# Altium schematic sheet USB HUB 3.0.SchDoc
size 381 x 304 mm
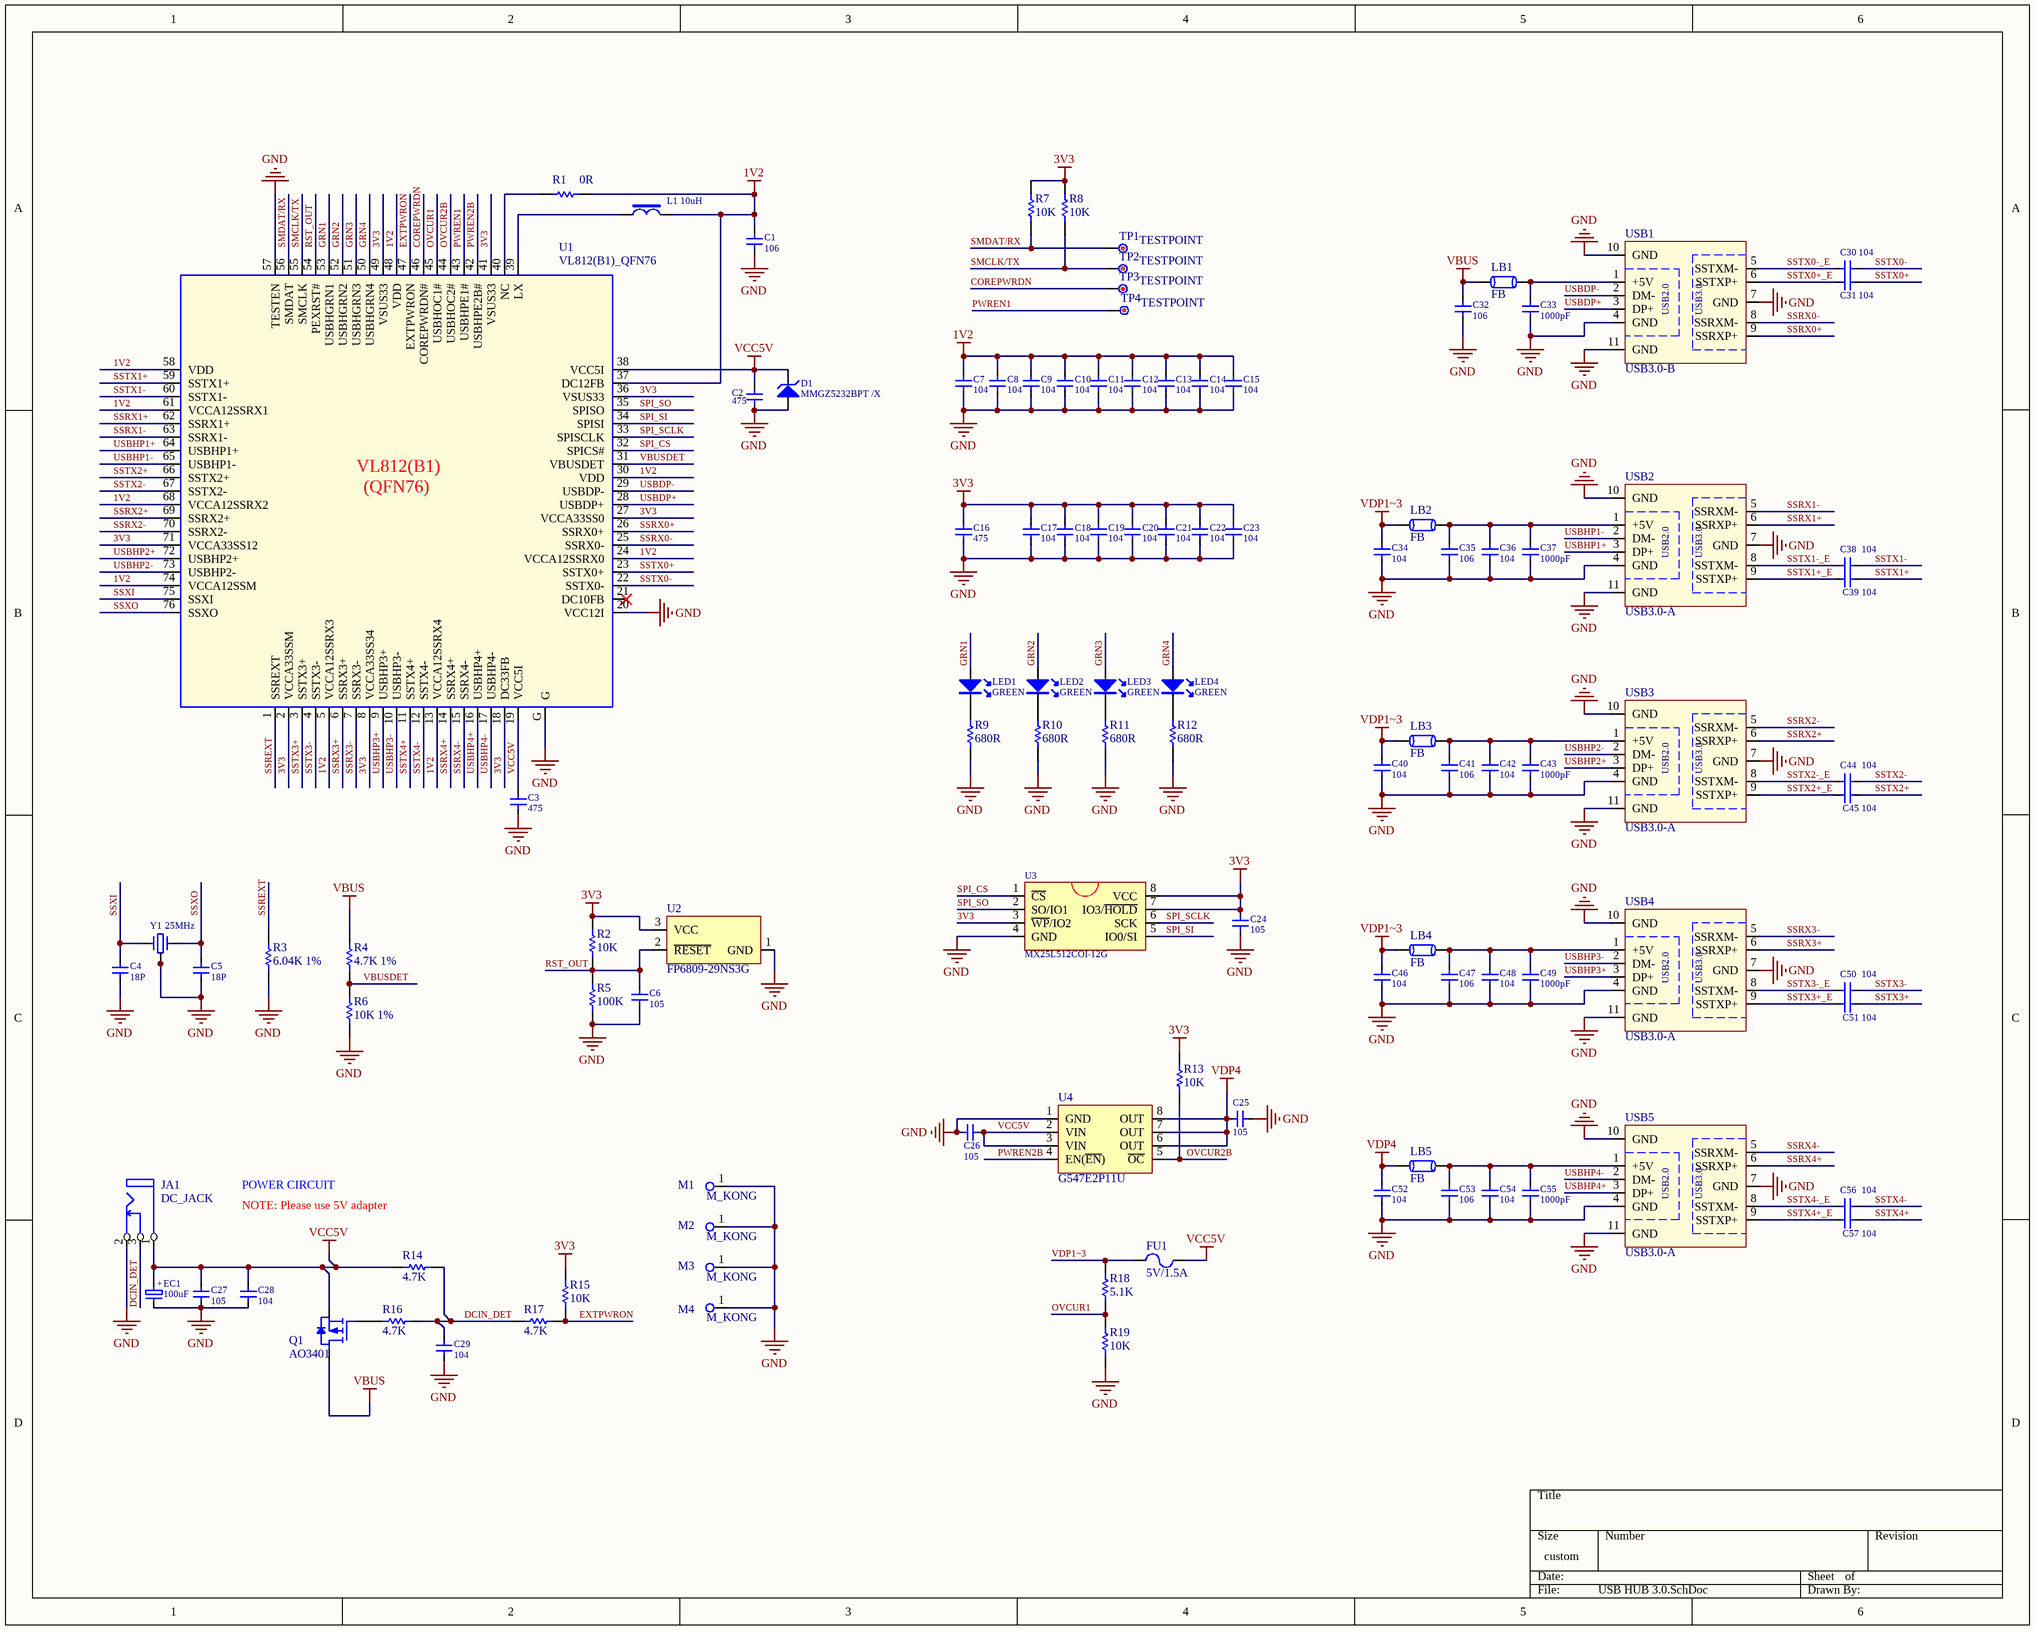
[diagram p0: USB HUB 3.0.SchDoc]

## Parts
C1  106  [C0603]
C2  475  [C0805]
C3  475  [C0805]
C4  18P  [C0402]
C5  18P  [C0402]
C6  105  [C0402]
C7  104  [C0402]
C8  104  [C0402]
C9  104  [C0402]
C10  104  [C0402]
C11  104  [C0402]
C12  104  [C0402]
C13  104  [C0402]
C14  104  [C0402]
C15  104  [C0402]
C16  475  [C0603]
C17  104  [C0402]
C18  104  [C0402]
C19  104  [C0402]
C20  104  [C0402]
C21  104  [C0402]
C22  104  [C0402]
C23  104  [C0402]
C24  105  [C0402]
C25  105  [C0402]
C26  105  [C0402]
C27  105  [C0603]
C28  104  [C0402]
C29  104  [C0402]
C30  104  [C0402]
C31  104  [C0402]
C32  106  [C0805]
C33  1000pF  [C0402]
C34  104  [C0402]
C35  106  [C0805]
C36  104  [C0402]
C37  1000pF  [C0402]
C38  104  [C0402]
C39  104  [C0402]
C40  104  [C0402]
C41  106  [C0805]
C42  104  [C0402]
C43  1000pF  [C0402]
C44  104  [C0402]
C45  104  [C0402]
C46  104  [C0402]
C47  106  [C0805]
C48  104  [C0402]
C49  1000pF  [C0402]
C50  104  [C0402]
C51  104  [C0402]
C52  104  [C0402]
C53  106  [C0805]
C54  104  [C0402]
C55  1000pF  [C0402]
C56  104  [C0402]
C57  104  [C0402]
D1  MMGZ5232BPT /X  [LL-34]
EC1  100uF  [C_SMD(6.3x7.7)]
FU1  5V/1.5A  [FU1210]
JA1  DC_JACK  [DC_005]
L1  10uH  [CD53]
LB1  FB  [L0805]
LB2  FB  [L0805]
LB3  FB  [L0805]
LB4  FB  [L0805]
LB5  FB  [L0805]
LED1  GREEN  [LED_0603]
LED2  GREEN  [LED_0603]
LED3  GREEN  [LED_0603]
LED4  GREEN  [LED_0603]
M1  M_KONG  [M3*8]
M2  M_KONG  [M3*8]
M3  M_KONG  [M3*8]
M4  M_KONG  [M3*8]
Q1  AO3401  [SOT23]
R1  0R  [R0402]
R2  10K  [R0402]
R3  6.04K 1%  [R0402]
R4  4.7K 1%  [R0402]
R5  100K  [R0402]
R6  10K 1%  [R0402]
R7  10K  [R0402]
R8  10K  [R0402]
R9  680R  [R0402]
R10  680R  [R0402]
R11  680R  [R0402]
R12  680R  [R0402]
R13  10K  [R0402]
R14  4.7K  [R0402]
R15  10K  [R0402]
R16  4.7K  [R0402]
R17  4.7K  [R0402]
R18  5.1K  [R0402]
R19  10K  [R0402]
TP1  TESTPOINT  [TP]
TP2  TESTPOINT  [TP]
TP3  TESTPOINT  [TP]
TP4  TESTPOINT  [TP]
U1  VL812(B1)_QFN76  [QFN76-0.4_9*9]
U2  FP6809-29NS3G  [SOT23]
U3  MX25L512COI-12G  [SOIC8]
U4  G547E2P11U  [SOP8]
USB1  USB3.0-B  [USB3.0-B]
USB2  USB3.0-A  [USB3.0-A]
USB3  USB3.0-A  [USB3.0-A]
USB4  USB3.0-A  [USB3.0-A]
USB5  USB3.0-A  [USB3.0-A]
Y1  25MHz  [0SC-3225_4]

## Nets
1V2: C1.1 C7.1 C8.1 C9.1 C10.1 C11.1 C12.1 C13.1 C14.1 C15.1 L1.2 R1.1 U1.5(VCCA12SSRX3) U1.13(VCCA12SSRX4) U1.24(VCCA12SSRX0) U1.30(VDD) U1.37(DC12FB) U1.48(VDD) U1.58(VDD) U1.61(VCCA12SSRX1) U1.68(VCCA12SSRX2) U1.74(VCCA12SSM)
3V3: C16.1 C17.1 C18.1 C19.1 C20.1 C21.1 C22.1 C23.1 C24.1 R2.1 R7.1 R8.1 R13.2 R15.2 U1.2(VCCA33SSM) U1.8(VCCA33SS34) U1.18(DC33FB) U1.27(VCCA33SS0) U1.36(VSUS33) U1.41(VSUS33) U1.49(VSUS33) U1.71(VCCA33SS12) U2.3(VCC) U3.3(~{WP}/IO2) U3.7(IO3/~{HOLD}) U3.8(VCC)
GND: C1.2 C2.2 C3.2 C4.2 C5.2 C6.2 C7.2 C8.2 C9.2 C10.2 C11.2 C12.2 C13.2 C14.2 C15.2 C16.2 C17.2 C18.2 C19.2 C20.2 C21.2 C22.2 C23.2 C24.2 C25.2 C26.1 C27.1 C28.1 C29.1 C32.2 C33.2 C34.2 C35.2 C36.2 C37.2 C40.2 C41.2 C42.2 C43.2 C46.2 C47.2 C48.2 C49.2 C52.2 C53.2 C54.2 C55.2 D1.1 EC1.2 JA1.2 M1.1 M2.1 M3.1 M4.1 R3.2 R5.2 R6.2 R9.2 R10.2 R11.2 R12.2 R19.2 U1.20(VCC12I) U1.57(TESTEN) U1.G U2.1(GND) U3.4(GND) U4.1(GND) USB1.4(GND) USB1.7(GND) USB1.10(GND) USB1.11(GND) USB2.4(GND) USB2.7(GND) USB2.10(GND) USB2.11(GND) USB3.4(GND) USB3.7(GND) USB3.10(GND) USB3.11(GND) USB4.4(GND) USB4.7(GND) USB4.10(GND) USB4.11(GND) USB5.4(GND) USB5.7(GND) USB5.10(GND) USB5.11(GND) Y1.3 Y1.4
VBUS: C32.1 LB1.1 Q1.3(D) R4.1
VCC5V: C2.1 C3.1 C26.2 C27.2 C28.2 D1.2 EC1.1 FU1.2 JA1.1 Q1.2(S) R14.1 U1.19(VCC5I) U1.38(VCC5I) U4.2(VIN) U4.3(VIN)
VDP1~3: C34.1 C40.1 C46.1 FU1.1 LB2.1 LB3.1 LB4.1 R18.1
VDP4: C25.1 C52.1 LB5.1 U4.6(OUT) U4.7(OUT) U4.8(OUT)
COREPWRDN: TP3.1 U1.46(COREPWRDN#)
DCIN_DET: C29.2 JA1.3 R14.2 R16.1 R17.2
EXTPWRON: R15.1 R17.1 U1.47(EXTPWRON)
GRN1: LED1.1(A) U1.53(USBHGRN1)
GRN2: LED2.1(A) U1.52(USBHGRN2)
GRN3: LED3.1(A) U1.51(USBHGRN3)
GRN4: LED4.1(A) U1.50(USBHGRN4)
OVCUR1: R18.2 R19.1 U1.45(USBHOC1#)
OVCUR2B: R13.1 U1.44(USBHOC2#) U4.5(~{OC})
PWREN1: TP4.1 U1.43(USBHPE1#)
PWREN2B: U1.42(USBHPE2B#) U4.4(EN(~{EN}))
RST_OUT: C6.1 R2.2 R5.1 U1.54(PEXRST#) U2.2(~{RESET})
SMCLK/TX: R8.2 TP2.1 U1.55(SMCLK)
SMDAT/RX: R7.2 TP1.1 U1.56(SMDAT)
SPI_CS: U1.32(SPICS#) U3.1(~{CS})
SPI_SCLK: U1.33(SPISCLK) U3.6(SCK)
SPI_SI: U1.34(SPISI) U3.5(IO0/SI)
SPI_SO: U1.35(SPISO) U3.2(SO/IO1)
SSREXT: R3.1 U1.1(SSREXT)
SSRX0+: U1.26(SSRX0+) USB1.9(SSRXP+)
SSRX0-: U1.25(SSRX0-) USB1.8(SSRXM-)
SSRX1+: U1.62(SSRX1+) USB2.6(SSRXP+)
SSRX1-: U1.63(SSRX1-) USB2.5(SSRXM-)
SSRX2+: U1.69(SSRX2+) USB3.6(SSRXP+)
SSRX2-: U1.70(SSRX2-) USB3.5(SSRXM-)
SSRX3+: U1.6(SSRX3+) USB4.6(SSRXP+)
SSRX3-: U1.7(SSRX3-) USB4.5(SSRXM-)
SSRX4+: U1.14(SSRX4+) USB5.6(SSRXP+)
SSRX4-: U1.15(SSRX4-) USB5.5(SSRXM-)
SSTX0+: C31.2 U1.23(SSTX0+)
SSTX0+_E: C31.1 USB1.6(SSTXP+)
SSTX0-: C30.2 U1.22(SSTX0-)
SSTX0-_E: C30.1 USB1.5(SSTXM-)
SSTX1+: C39.2 U1.59(SSTX1+)
SSTX1+_E: C39.1 USB2.9(SSTXP+)
SSTX1-: C38.2 U1.60(SSTX1-)
SSTX1-_E: C38.1 USB2.8(SSTXM-)
SSTX2+: C45.2 U1.66(SSTX2+)
SSTX2+_E: C45.1 USB3.9(SSTXP+)
SSTX2-: C44.2 U1.67(SSTX2-)
SSTX2-_E: C44.1 USB3.8(SSTXM-)
SSTX3+: C51.2 U1.3(SSTX3+)
SSTX3+_E: C51.1 USB4.9(SSTXP+)
SSTX3-: C50.2 U1.4(SSTX3-)
SSTX3-_E: C50.1 USB4.8(SSTXM-)
SSTX4+: C57.2 U1.11(SSTX4+)
SSTX4+_E: C57.1 USB5.9(SSTXP+)
SSTX4-: C56.2 U1.12(SSTX4-)
SSTX4-_E: C56.1 USB5.8(SSTXM-)
SSXI: C4.1 U1.75(SSXI) Y1.1
SSXO: C5.1 U1.76(SSXO) Y1.2
USBDP+: U1.28(USBDP+) USB1.3(DP+)
USBDP-: U1.29(USBDP-) USB1.2(DM-)
USBHP1+: U1.64(USBHP1+) USB2.3(DP+)
USBHP1-: U1.65(USBHP1-) USB2.2(DM-)
USBHP2+: U1.72(USBHP2+) USB3.3(DP+)
USBHP2-: U1.73(USBHP2-) USB3.2(DM-)
USBHP3+: U1.9(USBHP3+) USB4.3(DP+)
USBHP3-: U1.10(USBHP3-) USB4.2(DM-)
USBHP4+: U1.16(USBHP4+) USB5.3(DP+)
USBHP4-: U1.17(USBHP4-) USB5.2(DM-)
VBUSDET: R4.2 R6.1 U1.31(VBUSDET)
NetC33_1: C33.1 LB1.2 USB1.1(+5V)
NetC35_1: C35.1 C36.1 C37.1 LB2.2 USB2.1(+5V)
NetC41_1: C41.1 C42.1 C43.1 LB3.2 USB3.1(+5V)
NetC47_1: C47.1 C48.1 C49.1 LB4.2 USB4.1(+5V)
NetC53_1: C53.1 C54.1 C55.1 LB5.2 USB5.1(+5V)
NetL1_1: L1.1 U1.39(LX)
NetLED1_2: LED1.2(K) R9.1
NetLED2_2: LED2.2(K) R10.1
NetLED3_2: LED3.2(K) R11.1
NetLED4_2: LED4.2(K) R12.1
NetQ1_1: Q1.1(G) R16.2
NetR1_2: R1.2 U1.40(NC)

Not connected (* = marked no-connect by the designer): U1 21(DC10FB)*

## Notes on the sheet
- POWER CIRCUIT
- NOTE: Please use 5V adapter
- (in symbol ELECTRO) +
- (in symbol USB3.0-A) USB2.0; USB3.0
- (in symbol USB3.0-B) USB2.0; USB3.0
- (in symbol VL812(B1)_099) VL812(B1); (QFN76)

## Library data of the parts
C1-C57 = CAP: Capacitor
D1 = DIODE_Zener: 稳压二极管
EC1 = ELECTRO: Electrolytic Capacitor
FU1 = FUSE: 保险丝
JA1 = DC_JACK: 5V/9V电源座
L1 = INDUCTOR1: 磁芯/铁心电感
LB1-LB5 = FB: 磁珠
LED1-LED4 = LED: 发光二极管
Q1 = MOSFET-P: P-Channel MOSFET
R1 R3-R5 R9-R12 R14 R16-R18 = RES: 电阻; Res: 10K
R2 R6-R8 R13 R15 R19 = RES: 电阻; Res: 10K
TP1-TP4 = TP: 测试点
U1 = VL812(B1)_099: USB 3.0 HUB Controller
U2 = FP6809: 微处理器复位芯片
U3 = A25QXX: Flash; Part Field 1: FLASH
U4 = G547E2P11U: MOS管开关芯片
Y1 = CRYSTAL_4PIN: 晶振; Part Field 1: 晶振